# Altium project ESC_Board_DT.PrjPcb
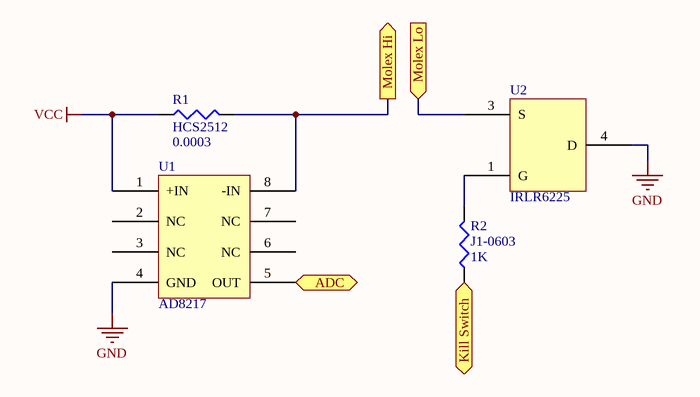
[diagram p0: BaseCircuit_DT.SchDoc]
1 sheet, 4 parts. Net scope: flat (ports and power ports of the same name join across sheets).
Board file: PCB_DT.PcbDoc

## Sheet BaseCircuit_DT.SchDoc
size A

### Parts
R1  HCS2512  value 0.0003  [HCS2512FTL300CT-ND_DT]
R2  J1-0603  value 1K  [J1-0603]
U1  AD8217  [AD8217_DT]
U2  IRLR6225  [IRLR6225_DT]

### Ports
ADC (out), Kill Switch (in), Molex Hi (out), Molex Lo (in)

### Nets
GND: U1.4(GND) U2.4(D)
VCC: R1.1 U1.1(+IN)
NetR1_2: R1.2 U1.8(-IN) ; port Molex Hi
NetR2_1: R2.1 ; port Kill Switch
NetR2_2: R2.2 U2.1(G)
NetU1_5: U1.5(OUT) ; port ADC
NetU2_3: U2.3(S) ; port Molex Lo

Not connected (* = marked no-connect by the designer): U1 2(NC) 3(NC) 6(NC) 7(NC)

### Library data of the parts
R1 R2 = Res3: Resistor; Published: 8-Jun-2000; LatestRevisionDate: 29-May-2009; LatestRevisionNote: IPC-7351 Footprint Added.; PackageReference: J1-0603; Publisher: Altium Limited; PackageDescription: Chip Resistor
U1 U2 = Component_1